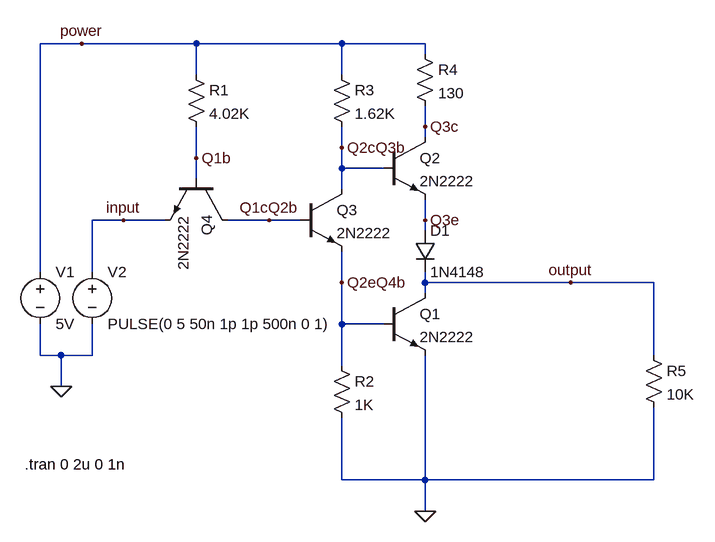
[diagram p0: schematic TTLinverter.asc]
TTLinverter.asc, the LTspice schematic file:
Version 4
SHEET 1 880 936
WIRE -736 -304 -800 -304
WIRE -560 -304 -736 -304
WIRE -336 -304 -560 -304
WIRE -208 -304 -336 -304
WIRE -208 -288 -208 -304
WIRE -560 -256 -560 -304
WIRE -336 -256 -336 -304
WIRE -208 -176 -208 -208
WIRE -208 -160 -208 -176
WIRE -336 -144 -336 -176
WIRE -560 -128 -560 -176
WIRE -336 -112 -336 -144
WIRE -272 -112 -336 -112
WIRE -560 -96 -560 -128
WIRE -336 -80 -336 -112
WIRE -672 -32 -720 -32
WIRE -608 -32 -672 -32
WIRE -448 -32 -512 -32
WIRE -400 -32 -448 -32
WIRE -208 -32 -208 -64
WIRE -208 -16 -208 -32
WIRE -800 48 -800 -304
WIRE -720 48 -720 -32
WIRE -336 64 -336 16
WIRE -208 64 -208 48
WIRE 16 64 -208 64
WIRE 144 64 16 64
WIRE -208 80 -208 64
WIRE -336 128 -336 64
WIRE -272 128 -336 128
WIRE -800 176 -800 128
WIRE -768 176 -800 176
WIRE -720 176 -720 128
WIRE -720 176 -768 176
WIRE 144 176 144 64
WIRE -336 192 -336 128
WIRE -768 224 -768 176
WIRE -336 368 -336 272
WIRE -208 368 -208 176
WIRE -208 368 -336 368
WIRE 144 368 144 256
WIRE 144 368 -208 368
WIRE -208 416 -208 368
FLAG -768 224 0
FLAG -208 416 0
FLAG 16 64 output
FLAG -672 -32 input
FLAG -448 -32 Q1cQ2b
FLAG -560 -128 Q1b
FLAG -336 -144 Q2cQ3b
FLAG -336 64 Q2eQ4b
FLAG -208 -176 Q3c
FLAG -208 -32 Q3e
FLAG -736 -304 power
SYMBOL res -576 -272 R0
SYMATTR InstName R1
SYMATTR Value 4.02K
SYMBOL res -352 176 R0
SYMATTR InstName R2
SYMATTR Value 1K
SYMBOL res -352 -272 R0
SYMATTR InstName R3
SYMATTR Value 1.62K
SYMBOL res -224 -304 R0
SYMATTR InstName R4
SYMATTR Value 130
SYMBOL res 128 160 R0
SYMATTR InstName R5
SYMATTR Value 10K
SYMBOL voltage -800 32 R0
WINDOW 123 0 0 Left 2
WINDOW 39 0 0 Left 2
SYMATTR InstName V1
SYMATTR Value 5V
SYMBOL voltage -720 32 R0
WINDOW 123 0 0 Left 2
WINDOW 39 0 0 Left 2
SYMATTR InstName V2
SYMATTR Value PULSE(0 5 50n 1p 1p 500n 0 1)
SYMBOL npn -512 -96 R90
SYMATTR InstName Q4
SYMATTR Value 2N2222
SYMBOL npn -400 -80 R0
SYMATTR InstName Q3
SYMATTR Value 2N2222
SYMBOL npn -272 -160 R0
SYMATTR InstName Q2
SYMATTR Value 2N2222
SYMBOL npn -272 80 R0
SYMATTR InstName Q1
SYMATTR Value 2N2222
SYMBOL diode -224 -16 R0
SYMATTR InstName D1
SYMATTR Value 1N4148
TEXT -824 344 Left 2 !.tran 0 2u 0 1n

The netlist it stands for:
* TTLinverter.asc
R1 power Q1b 4.02K
R2 Q2eQ4b 0 1K
R3 power Q2cQ3b 1.62K
R4 power Q3c 130
R5 output 0 10K
V1 power 0 5V
V2 input 0 PULSE(0 5 50n 1p 1p 500n 0 1)
Q4 Q1cQ2b Q1b input 0 2N2222
Q3 Q2cQ3b Q1cQ2b Q2eQ4b 0 2N2222
Q2 Q3c Q2cQ3b Q3e 0 2N2222
Q1 output Q2eQ4b 0 0 2N2222
D1 Q3e output 1N4148
.model D D
.lib standard.dio
.model NPN NPN
.model PNP PNP
.lib standard.bjt
.tran 0 2u 0 1n
.backanno
.end

* Results of the author's LTspice run, read from the files saved beside the schematic
* Operating Point, zero values left out:
*   V(power) = 5 V
*   V(q1b) = 703.2 mV
*   V(q2cq3b) = 4.997 V
*   V(q3c) = 4.951 V
*   V(output) = 3.826 V
*   V(q1cq2b) = 7.789 mV
*   V(q3e) = 4.367 V
*   Ic(Q1) = 3.838 pA
*   Ib(Q1) = -3.829 pA
*   Ic(Q2) = 380.7 µA
*   Ib(Q2) = 1.907 µA
*   Ie(Q2) = -382.6 µA
*   Ic(Q3) = 5.006 pA
*   Ib(Q3) = -4.985 pA
*   Ic(Q4) = 4.985 pA
*   Ib(Q4) = 1.069 mA
*   Ie(Q4) = -1.069 mA
*   I(D1) = 382.6 µA
*   I(R5) = 382.6 µA
*   I(R4) = 380.7 µA
*   I(R3) = 1.907 µA
*   I(R2) = 3.851 pA
*   I(R1) = 1.069 mA
*   I(V2) = 1.069 mA
*   I(V1) = -1.451 mA
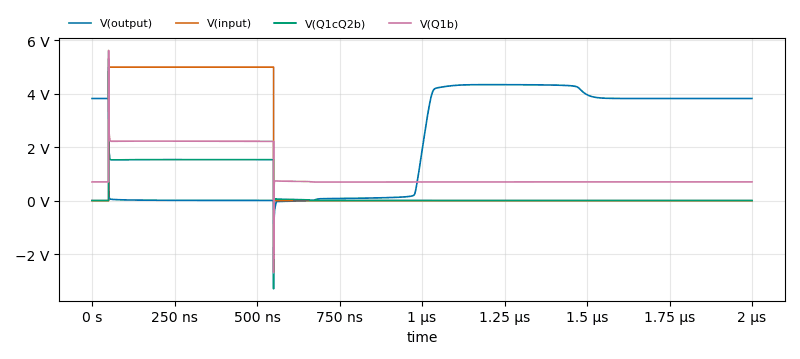
[diagram p1: Transient Analysis of TTLinverter.asc, plotted from the saved traces]
* Transient Analysis, 1 run:
*   V(output): min -890.3 mV, max 5.316 V, average 2.141 V, rms 2.926 V, last 3.826 V
*   V(input): min 0 V, max 5 V, average 1.25 V, rms 2.5 V, last 0 V
*   V(Q1cQ2b): min -3.298 V, max 4.851 V, average 392.6 mV, rms 771.4 mV, last 7.813 mV
*   V(Q1b): min -2.694 V, max 5.627 V, average 1.085 V, rms 1.271 V, last 703.2 mV